# Altium schematic sheet power.SchDoc
size A3
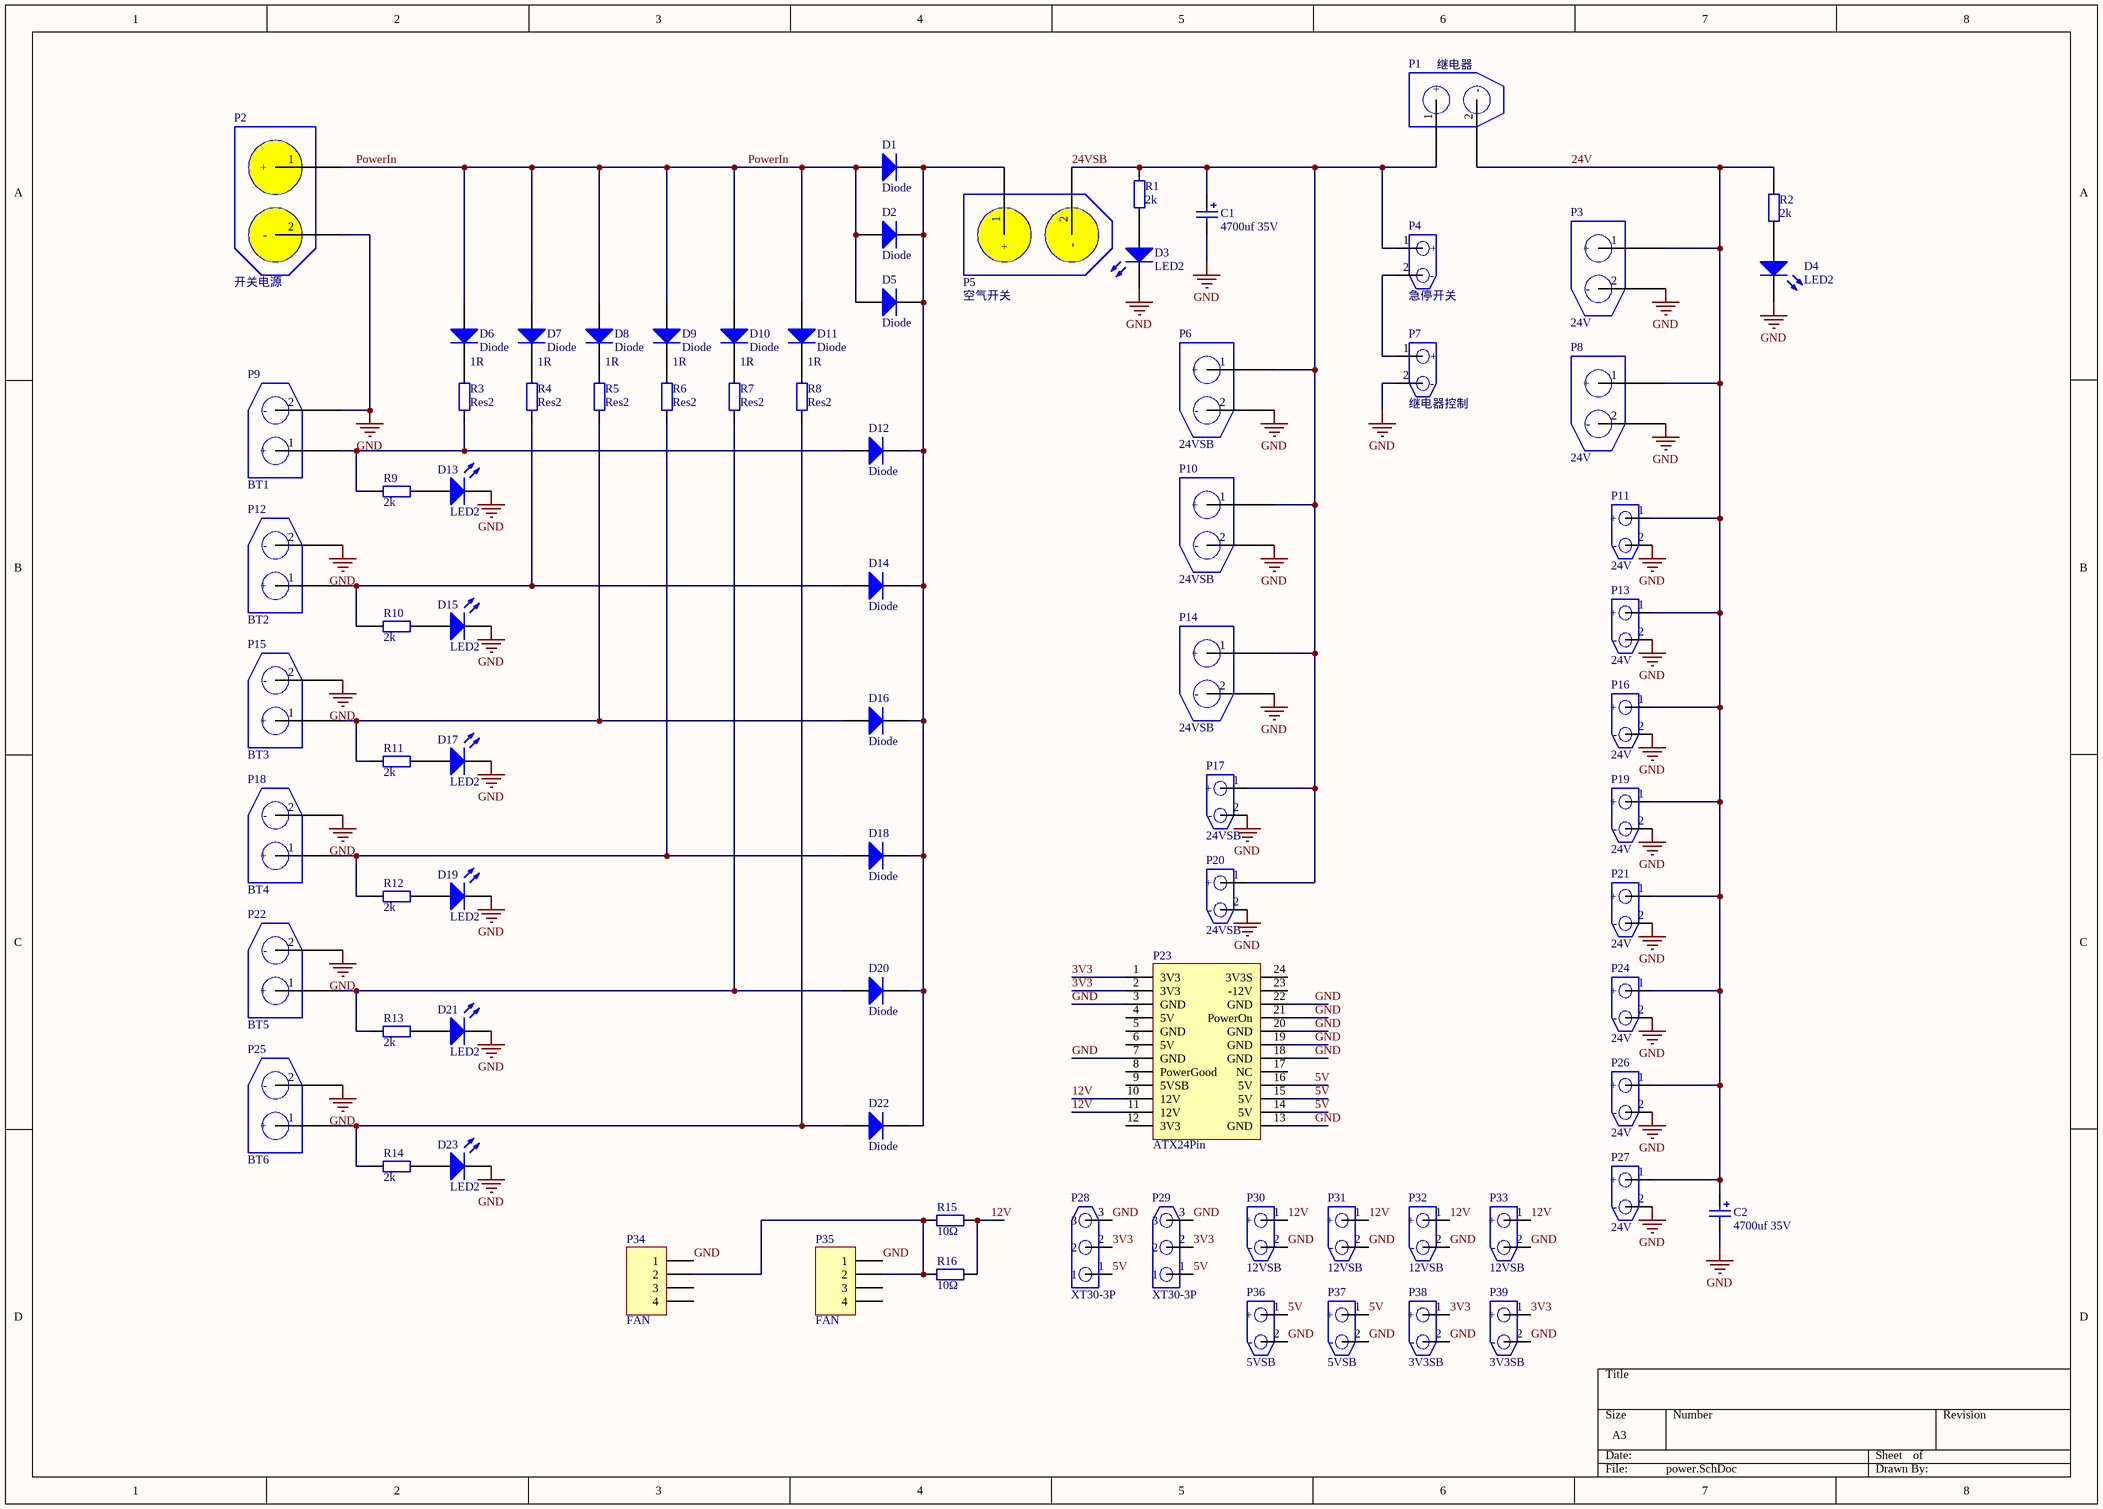
[diagram p0: power.SchDoc]

## Parts
C1  value 4700uf 35V  [C1675]  (hidden comment: Cap Pol2)
C2  value 4700uf 35V  [C1675]  (hidden comment: Cap Pol2)
D1  Diode  [TO-247-2-S]
D2  Diode  [TO-247-2-S]
D3  LED2  [1608[0603]big]
D4  LED2  [1608[0603]big]
D5  Diode  [TO-247-2-S]
D6  Diode  [TO-263]
D7  Diode  [TO-263]
D8  Diode  [TO-263]
D9  Diode  [TO-263]
D10  Diode  [TO-263]
D11  Diode  [TO-263]
D12  Diode  [TO-247-2-S]
D13  LED2  [1608[0603]big]
D14  Diode  [TO-247-2-S]
D15  LED2  [1608[0603]big]
D16  Diode  [TO-247-2-S]
D17  LED2  [1608[0603]big]
D18  Diode  [TO-247-2-S]
D19  LED2  [1608[0603]big]
D20  Diode  [TO-247-2-S]
D21  LED2  [1608[0603]big]
D22  Diode  [TO-247-2-S]
D23  LED2  [1608[0603]big]
P1  继电器  [XT60]
P2  开关电源  [EC5-WIRE]
P3  24V  [XT60]
P4  急停开关  [XT30PCB]
P5  空气开关  [EC5-WIRE]
P6  24VSB  [XT60]
P7  继电器控制  [XT30PCB]
P8  24V  [XT60]
P9  BT1  [XT60]
P10  24VSB  [XT60]
P11  24V  [XT30PCB]
P12  BT2  [XT60]
P13  24V  [XT30PCB]
P14  24VSB  [XT60]
P15  BT3  [XT60]
P16  24V  [XT30PCB]
P17  24VSB  [XT30PCB]
P18  BT4  [XT60]
P19  24V  [XT30PCB]
P20  24VSB  [XT30PCB]
P21  24V  [XT30PCB]
P22  BT5  [XT60]
P23  ATX24Pin  [ATX24P]
P24  24V  [XT30PCB]
P25  BT6  [XT60]
P26  24V  [XT30PCB]
P27  24V  [XT30PCB]
P28  XT30-3P  [MR30PCB]
P29  XT30-3P  [MR30PCB]
P30  12VSB  [XT30PCB]
P31  12VSB  [XT30PCB]
P32  12VSB  [XT30PCB]
P33  12VSB  [XT30PCB]
P34  FAN  [HDR1X4]
P35  FAN  [HDR1X4]
P36  5VSB  [XT30PCB]
P37  5VSB  [XT30PCB]
P38  3V3SB  [XT30PCB]
P39  3V3SB  [XT30PCB]
R1  value 2k  [1608[0603]big]  (hidden comment: Res2)
R2  value 2k  [1608[0603]big]  (hidden comment: Res2)
R3  Res2  value 1R  [RX24-30W]
R4  Res2  value 1R  [RX24-30W]
R5  Res2  value 1R  [RX24-30W]
R6  Res2  value 1R  [RX24-30W]
R7  Res2  value 1R  [RX24-30W]
R8  Res2  value 1R  [RX24-30W]
R9  value 2k  [1608[0603]big]  (hidden comment: Res2)
R10  value 2k  [1608[0603]big]  (hidden comment: Res2)
R11  value 2k  [1608[0603]big]  (hidden comment: Res2)
R12  value 2k  [1608[0603]big]  (hidden comment: Res2)
R13  value 2k  [1608[0603]big]  (hidden comment: Res2)
R14  value 2k  [1608[0603]big]  (hidden comment: Res2)
R15  value 10Ω  [SMC]  (hidden comment: Res2)
R16  value 10Ω  [SMC]  (hidden comment: Res2)

## Nets
GND: C1.2 C2.2 D3.2(K) D4.2(K) D13.2(K) D15.2(K) D17.2(K) D19.2(K) D21.2(K) D23.2(K) P2.2(-) P3.2(-) P6.2(-) P7.2(-) P8.2(-) P9.2(-) P10.2(-) P11.2(-) P12.2(-) P13.2(-) P14.2(-) P15.2(-) P16.2(-) P17.2(-) P18.2(-) P19.2(-) P20.2(-) P21.2(-) P22.2(-) P23.3(GND) P23.7(GND) P23.13(GND) P23.18(GND) P23.19(GND) P23.20(GND) P23.21(PowerOn) P23.22(GND) P24.2(-) P25.2(-) P26.2(-) P27.2(-) P28.3 P29.3 P30.2(-) P31.2(-) P32.2(-) P33.2(-) P34.1 P35.1 P36.2(-) P37.2(-) P38.2(-) P39.2(-)
3V3: P23.1(3V3) P23.2(3V3) P28.2 P29.2 P38.1(+) P39.1(+)
5V: P23.14(5V) P23.15(5V) P23.16(5V) P28.1 P29.1 P36.1(+) P37.1(+)
12V: P23.10(12V) P23.11(12V) P30.1(+) P31.1(+) P32.1(+) P33.1(+) R15.1 R16.1
24V: C2.1 P1.2(-) P3.1(+) P8.1(+) P11.1(+) P13.1(+) P16.1(+) P19.1(+) P21.1(+) P24.1(+) P26.1(+) P27.1(+) R2.2
24VSB: C1.1 P1.1(+) P4.1(+) P5.2(-) P6.1(+) P10.1(+) P14.1(+) P17.1(+) P20.1(+) R1.2
PowerIn: D1.1(A) D2.1(A) D5.1(A) D6.1(A) D7.1(A) D8.1(A) D9.1(A) D10.1(A) D11.1(A) P2.1(+)
NetD1_2: D1.2(K) D2.2(K) D5.2(K) D12.2(K) D14.2(K) D16.2(K) D18.2(K) D20.2(K) D22.2(K) P5.1(+)
NetD3_1: D3.1(A) R1.1
NetD4_1: D4.1(A) R2.1
NetD6_2: D6.2(K) R3.2
NetD7_2: D7.2(K) R4.2
NetD8_2: D8.2(K) R5.2
NetD9_2: D9.2(K) R6.2
NetD10_2: D10.2(K) R7.2
NetD11_2: D11.2(K) R8.2
NetD12_1: D12.1(A) P9.1(+) R3.1 R9.2
NetD13_1: D13.1(A) R9.1
NetD14_1: D14.1(A) P12.1(+) R4.1 R10.2
NetD15_1: D15.1(A) R10.1
NetD16_1: D16.1(A) P15.1(+) R5.1 R11.2
NetD17_1: D17.1(A) R11.1
NetD18_1: D18.1(A) P18.1(+) R6.1 R12.2
NetD19_1: D19.1(A) R12.1
NetD20_1: D20.1(A) P22.1(+) R7.1 R13.2
NetD21_1: D21.1(A) R13.1
NetD22_1: D22.1(A) P25.1(+) R8.1 R14.2
NetD23_1: D23.1(A) R14.1
NetP4_2: P4.2(-) P7.1(+)
NetP34_2: P34.2 P35.2 R15.2 R16.2

Not connected (* = marked no-connect by the designer): P23 4(5V) 5(GND) 6(5V) 8(PowerGood) 9(5VSB) 12(3V3) 17(NC) 23(-12V) 24(3V3S); P34 3 4; P35 3 4

## Library data of the parts
C1 C2 = Cap Pol2: Polarized Capacitor (Axial); Published: 8-Jun-2000; LatestRevisionDate: 17-Jul-2002; LatestRevisionNote: Re-released for DXP Platform.; PackageReference: POLAR0.8; Publisher: Altium Limited; PackageDescription: Polarized Capacitor; 2 Leads
D1 D2 D5-D12 D14 D16 D18 D20 D22 = Diode: Default Diode; Published: 8-Jun-2000; LatestRevisionDate: 17-Jul-2002; LatestRevisionNote: Re-released for DXP Platform.; PackageVersion: Sep-1996; PackageReference: SMC; Publisher: Altium Limited; PackageDescription: DO-214-AB/SMC; 2 C-Bend Leads; Body 7.9 x 5.9 mm, inc. leads (LxW); Code_JEDEC: DO-214-AB
D3 D4 D13 D15 D17 D19 D21 D23 = LED2: Typical RED, GREEN, YELLOW, AMBER GaAs LED; Published: 8-Jun-2000; LatestRevisionDate: 17-Jul-2002; LatestRevisionNote: Re-released for DXP Platform.; PackageVersion: Feb-2002; PackageReference: 3.2X1.6X1.1; Publisher: Altium Limited; PackageDescription: SM LED; 2 Flat Leads
P1 P3 P6 P8-P10 P12 P14 P15 P18 P22 P25 = XT60
P2 P5 = XT150
P4 P7 P11 P13 P16 P17 P19-P21 P24 P26 P27 P30-P33 P36-P39 = XT30
P23 = ATX24P
P34 P35 = Header 4: Header, 4-Pin; LatestRevisionDate: 17-Jul-2002; LatestRevisionNote: Re-released for DXP Platform.; Publisher: Altium Limited
R1-R16 = Res2: Resistor; Published: 8-Jun-2000; LatestRevisionDate: 17-Jul-2002; LatestRevisionNote: Re-released for DXP Platform.; PackageReference: AXIAL-0.4; Publisher: Altium Limited; PackageDescription: Axial Device, Thru-Hole; 2 Leads; 0.4 in Pin Spacing